# Altium project SageSensorRingLight.PrjPcb
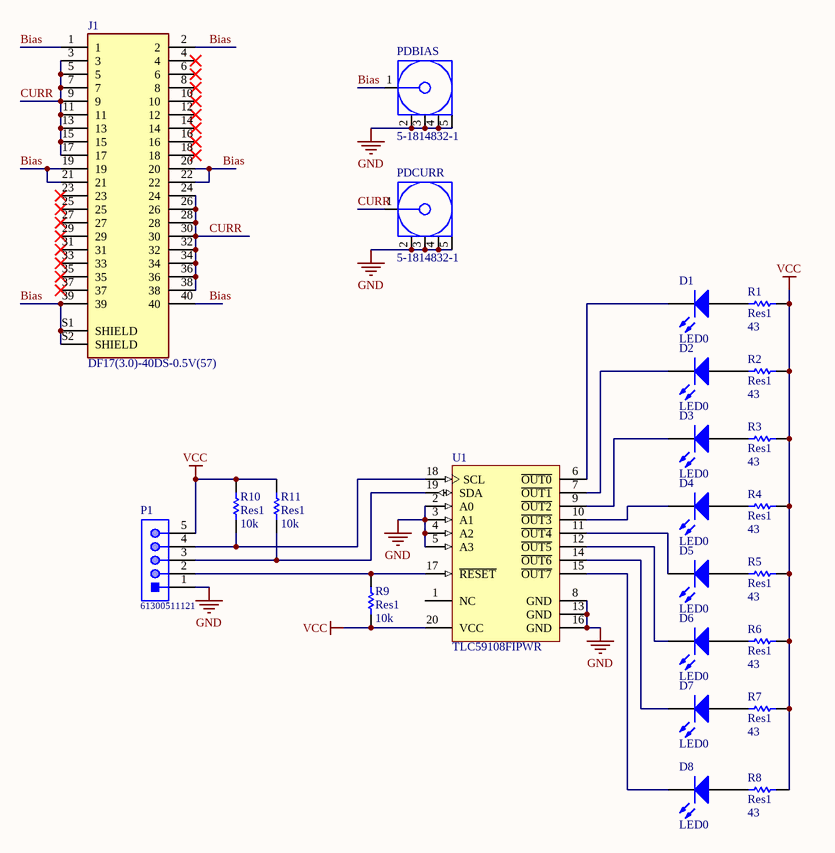
[diagram p0: Sheet1.SchDoc]
1 sheet, 24 parts. Net scope: global (net labels, ports and power ports of the same name join across sheets).
Board file: PCB1.PcbDoc

## Sheet Sheet1.SchDoc
size A; SheetNumber: 1; SheetTotal: 1; SPICEModelCachePSSFBRDB: <root> / <DocumentId>PSSFBRDB</DocumentId> / <CacheFrame Number="0"> / <Model Name="led0" Kind="MDL"> / <Text>*Typ INFRARED GaAs LED: Vf=1.2V Vr=5V If=40mA trr=3uS / *LED Pinout: 1=A, 2=K / .MODEL LED0 D (IS=93.5P RS=84M N=2.63 BV=5 IBV=10U / + CJO=2.97P VJ=.75 M=.333 TT=4.32U)</Text> / </Model> / </CacheFrame> / </root>

### Parts
D1  LED0  [TO-18]
D2  LED0  [TO-18]
D3  LED0  [TO-18]
D4  LED0  [TO-18]
D5  LED0  [TO-18]
D6  LED0  [TO-18]
D7  LED0  [TO-18]
D8  LED0  [TO-18]
J1  DF17(3.0)-40DS-0.5V(57)  [HRS_DF17(3.0)-40DS-0.5V(57)]
P1  61300511121  [61300511121]
PDBIAS  5-1814832-1  [TECO-5-1814832-1_V]
PDCURR  5-1814832-1  [TECO-5-1814832-1_V]
R1  Res1  value 43  [6-0805_L]
R2  Res1  value 43  [6-0805_L]
R3  Res1  value 43  [6-0805_L]
R4  Res1  value 43  [6-0805_L]
R5  Res1  value 43  [6-0805_L]
R6  Res1  value 43  [6-0805_L]
R7  Res1  value 43  [6-0805_L]
R8  Res1  value 43  [6-0805_L]
R9  Res1  value 10k  [6-0805_L]
R10  Res1  value 10k  [6-0805_L]
R11  Res1  value 10k  [6-0805_L]
U1  TLC59108FIPWR  [PW0020A_L]

### Nets
GND: P1.1 PDBIAS.2 PDBIAS.3 PDBIAS.4 PDBIAS.5 PDCURR.2 PDCURR.3 PDCURR.4 PDCURR.5 U1.2(A0) U1.3(A1) U1.4(A2) U1.5(A3) U1.8(GND) U1.13(GND) U1.16(GND)
VCC: P1.5 R1.2 R2.2 R3.2 R4.2 R5.2 R6.2 R7.2 R8.2 R9.2 R10.1 R11.1 U1.20(VCC)
Bias: J1.1 J1.2 J1.19 J1.20 J1.21 J1.22 J1.39 J1.40 J1.S1(SHIELD) J1.S2(SHIELD) PDBIAS.1
CURR: J1.3 J1.5 J1.7 J1.9 J1.11 J1.13 J1.15 J1.17 J1.24 J1.26 J1.28 J1.30 J1.32 J1.34 J1.36 J1.38 PDCURR.1
NetD1_1: D1.1(A) R1.1
NetD1_2: D1.2(K) U1.6(~{OUT0})
NetD2_1: D2.1(A) R2.1
NetD2_2: D2.2(K) U1.7(~{OUT1})
NetD3_1: D3.1(A) R3.1
NetD3_2: D3.2(K) U1.9(~{OUT2})
NetD4_1: D4.1(A) R4.1
NetD4_2: D4.2(K) U1.10(~{OUT3})
NetD5_1: D5.1(A) R5.1
NetD5_2: D5.2(K) U1.11(~{OUT4})
NetD6_1: D6.1(A) R6.1
NetD6_2: D6.2(K) U1.12(~{OUT5})
NetD7_1: D7.1(A) R7.1
NetD7_2: D7.2(K) U1.14(~{OUT6})
NetD8_1: D8.1(A) R8.1
NetD8_2: D8.2(K) U1.15(~{OUT7})
NetP1_2: P1.2 R9.1 U1.17(~{RESET})
NetP1_3: P1.3 R11.2 U1.19(SDA)
NetP1_4: P1.4 R10.2 U1.18(SCL)

Not connected (* = marked no-connect by the designer): J1 4* 6* 8* 10* 12* 14* 16* 18* 23* 25* 27* 29* 31* 33* 35* 37*; U1 1(NC)

### Library data of the parts
D1-D8 = LED0: Typical INFRARED GaAs LED; Published: 8-Jun-2000; LatestRevisionDate: 08-Jul-2005; LatestRevisionNote: Mech Layer 1 removed.; PackageReference: LED-0; Publisher: Altium Limited; PackageDescription: LED; 2 Leads
J1 = DF17(3.0)-40DS-0.5V(57): Conn Board to Board RCP 40 POS 0.5mm Solder ST SMD Embossed T/R; Value: *; Availability: Unavailable; Price: None; Package: None; MP: DF17(3.0)-40DS-0.5V(57)
P1 = CMP-1502-01068-1: THT Vertical Pin Header WR-PHD, Pitch 2.54 mm, Single Row, 5 pins; Manufacturer: Wurth Elektronik; Pin Number: 5; Contact Resistance: 20mOhm; Working Voltage: 250VAC; Pitch: 2.54mm; Withstanding Voltage: 500VAC; Rated Current: 3A; Gender: Male; Datasheet URL: https://katalog.we-online.de/em/datasheet/6130xx11121.pdf; Orientation: Vertical; Mounting Technology: THT; Row Number: Single; Package Reference: 61300511121; Publisher: WurthElektronik; Part Number: 61300511121; Packaging: Bag; Manufacturer URL: http://www.we-online.de; Operating Temperature: -40to105degC
PDBIAS PDCURR = CMP-2000-05415-1: SMA Connector, Pitch 5.08 mm, 1 Position, Height 9.5 mm, Tail Length 4 mm, -65 to 165 degC, RoHS, Bulk; Manufacturer: TE Connectivity; Connector Mounting: PCBMount; Connector Body Style: StraightJack; Impedance: 50ohm; Coaxial Termination: Solder; SVHC: NoSVHC(15-Jun-2015); Frequency Max: 3GHz; Product Range: ZDCSeries; Connector Type: SMACoaxial; Datasheet Version: Rev. B1, 03/2011; Package Reference: 5-1814832-1; Package Description: SMA Connector, Pitch 5.08 mm, 1 Position, Height 9.5 mm, Tail Length 4 mm; Contact Plating: GoldPlatedContacts; Coaxial Cable Types: -; Contact Material: BerylliumCopper; Manufacturer URL: http://www.te.com/; Datasheet URL: http://www.onlinecomponents.com/productFiles/mf-AMP/eng_cd_1814832_a.pdf
R1-R11 = Res1: Resistor; Published: 8-Jun-2000; LatestRevisionDate: 17-Jul-2002; LatestRevisionNote: Re-released for DXP Platform.; PackageReference: AXIAL-0.3; Publisher: Altium Limited; PackageDescription: Axial Device, Thru-Hole; 2 Leads; 0.3 in Pin Spacing
U1 = CMP-0388-00395-2: 8-Bit Fast-Mode Plus (FM+) I2C Bus LED Driver, 3 to 5.5 V, -40 to 85 degC, 20-pin SOP (PW20), Green (RoHS & no Sb/Br); Manufacturer: Texas Instruments; Iout(Max)(A): 0.12; Vin(Max)(V): 5.5; Vin(Min)(V): 3; SubFamily: LED Driver; PackageReference: PW0020A; ComponentLink2URL: http://www.ti.com/general/docs/lit/getliterature.tsp?genericPartNumber=TLC59108F&fileType=pdf; PartNumber: TLC59108FIPWR; Mounting Technology: Surface Mount; ComponentLink2Description: Datasheet; DatasheetVersion: SLDS162A; ComponentLink1Description: Manufacturer URL; Code_JEDEC: MO-153; Eco-Plan: Green (RoHS & no Sb/Br); ComponentLink3URL: http://www.ti.com.cn/cn/lit/ml/mpds362/mpds362.pdf; ComponentLink1URL: http://www.ti.com/; ComponentLink3Description: Package Specification; PackageVersion: 4040064-5/G; PackageDescription: 20-Pin Plastic Small Outline, Body 6.5 x 4.4 mm, 0.65 mm Pitch